# Altium project Cape.PrjPcb (part 1 of 2)
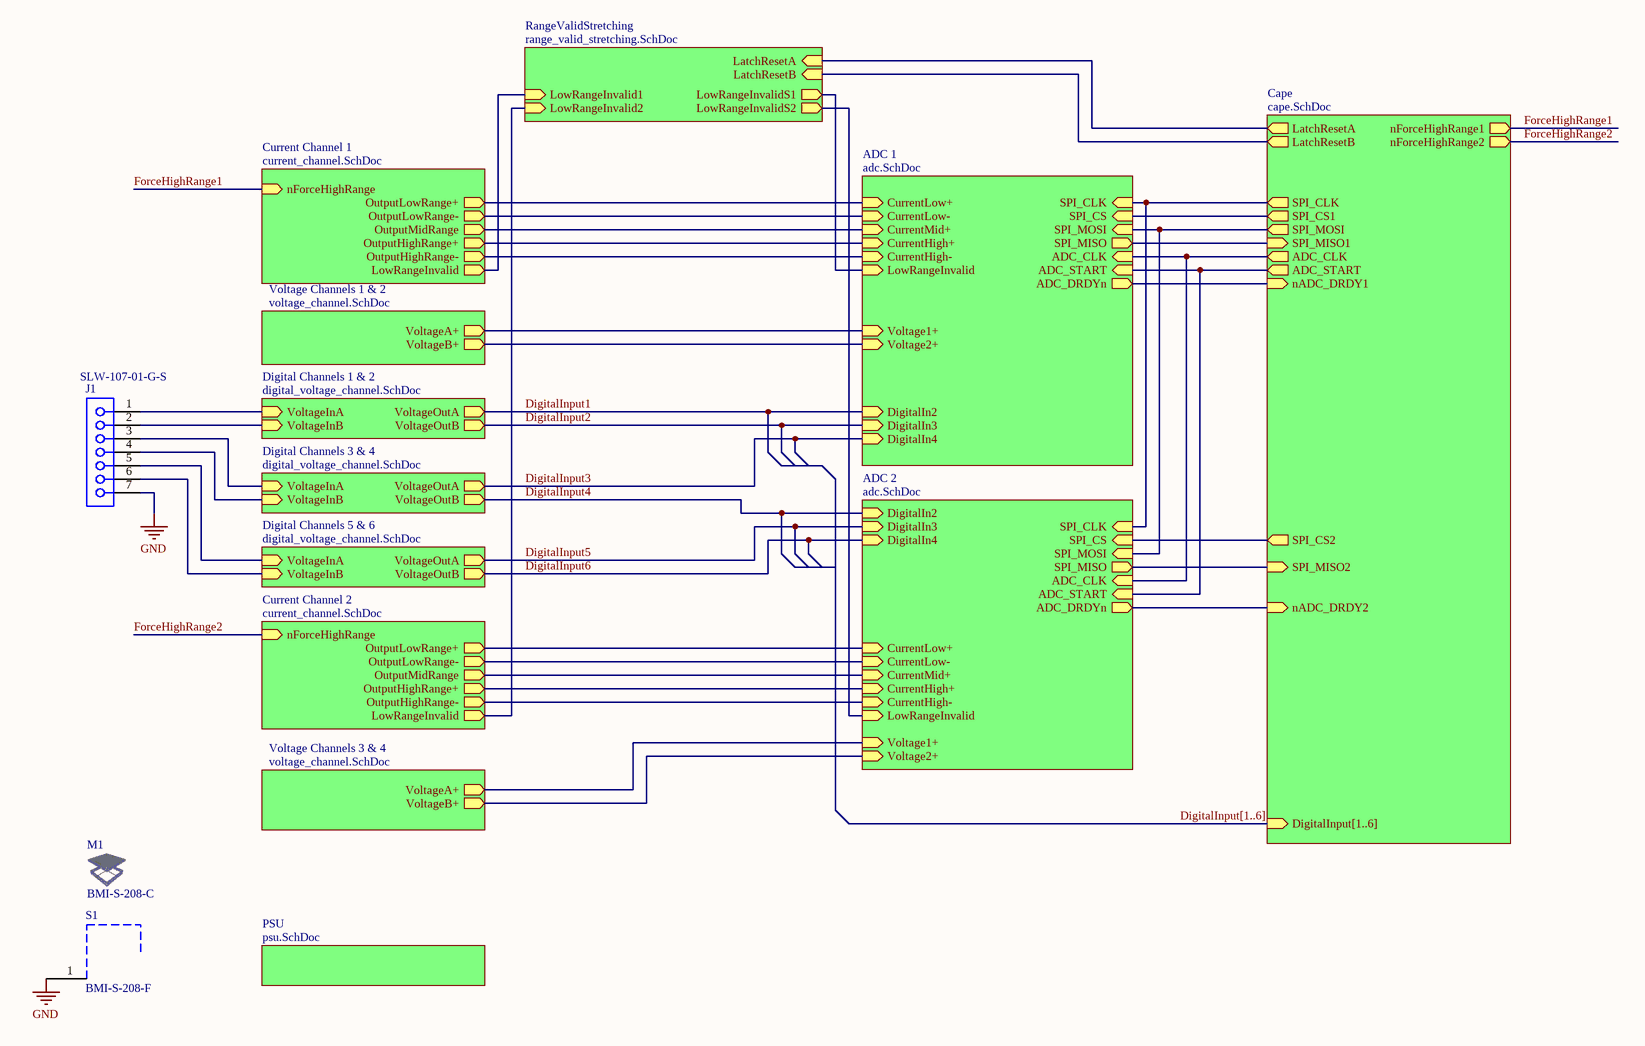
[diagram p0: top.SchDoc]
ProjectName: RocketLogger
8 sheets, 414 parts. Net scope: hierarchical (ports join the sheet entries above them; power ports are global).
Board file: PCB.PcbDoc
Sheets:
  top.SchDoc
    Current Channel 1 = current_channel.SchDoc
    ADC 1 = adc.SchDoc
    PSU = psu.SchDoc
    Cape = cape.SchDoc
    Voltage Channels 3 & 4 = voltage_channel.SchDoc
    Current Channel 2 = current_channel.SchDoc
    Voltage Channels 1 & 2 = voltage_channel.SchDoc
    ADC 2 = adc.SchDoc
    Digital Channels 1 & 2 = digital_voltage_channel.SchDoc
    Digital Channels 3 & 4 = digital_voltage_channel.SchDoc
    Digital Channels 5 & 6 = digital_voltage_channel.SchDoc
    RangeValidStretching = range_valid_stretching.SchDoc

## Sheet top.SchDoc: Top
size A3; DrawnBy: Stefan Lippuner; Organization: TIK; DocumentNumber: 1; Revision: 1; SheetNumber: 1; SheetTotal: 8; ProjectName: RocketLogger

### Parts
J1  SLW-107-01-G-S  [SMTC-SLW-107-01-X-S]
M1  BMI-S-208-C  (mechanical)
S1  BMI-S-208-F  [BMI-S-208-F]

### Sub-sheets
ADC 1 = adc.SchDoc: Voltage1+ (in), Voltage2+ (in), CurrentHigh+ (in), CurrentHigh- (in), CurrentLow+ (in), SPI_CS (in), ADC_DRDYn (out), SPI_MOSI (in), ADC_CLK (in), ADC_START (in), SPI_CLK (in), SPI_MISO (out), LowRangeInvalid (in), DigitalIn3 (in), DigitalIn4 (in), DigitalIn2 (in), CurrentMid+ (in), CurrentLow- (in)
ADC 2 = adc.SchDoc: Voltage1+ (in), Voltage2+ (in), CurrentHigh+ (in), CurrentHigh- (in), CurrentLow+ (in), SPI_CS (in), ADC_DRDYn (out), SPI_MOSI (in), ADC_CLK (in), ADC_START (in), SPI_CLK (in), SPI_MISO (out), LowRangeInvalid (in), DigitalIn3 (in), DigitalIn4 (in), DigitalIn2 (in), CurrentMid+ (in), CurrentLow- (in)
Cape = cape.SchDoc: nADC_DRDY2 (in), SPI_CS1 (out), ADC_CLK (out), SPI_CS2 (out), ADC_START (out), nForceHighRange1 (out), nForceHighRange2 (out), SPI_CLK (out), SPI_MOSI (out), nADC_DRDY1 (in), SPI_MISO1 (in), SPI_MISO2 (in), LatchResetA (out), LatchResetB (out), DigitalInput[1..6] (in)
Current Channel 1 = current_channel.SchDoc: nForceHighRange (in), LowRangeInvalid (out), OutputHighRange+ (out), OutputLowRange+ (out), OutputHighRange- (out), OutputMidRange (out), OutputLowRange- (out)
Current Channel 2 = current_channel.SchDoc: nForceHighRange (in), LowRangeInvalid (out), OutputLowRange+ (out), OutputHighRange+ (out), OutputHighRange- (out), OutputMidRange (out), OutputLowRange- (out)
Digital Channels 1 & 2 = digital_voltage_channel.SchDoc: VoltageOutA (out), VoltageInB (in), VoltageInA (in), VoltageOutB (out)
Digital Channels 3 & 4 = digital_voltage_channel.SchDoc: VoltageOutA (out), VoltageInB (in), VoltageInA (in), VoltageOutB (out)
Digital Channels 5 & 6 = digital_voltage_channel.SchDoc: VoltageOutA (out), VoltageInB (in), VoltageInA (in), VoltageOutB (out)
PSU = psu.SchDoc: no entries
RangeValidStretching = range_valid_stretching.SchDoc: LowRangeInvalid1 (in), LowRangeInvalidS2 (out), LatchResetB (in), LowRangeInvalid2 (in), LatchResetA (in), LowRangeInvalidS1 (out)
Voltage Channels 1 & 2 = voltage_channel.SchDoc: VoltageB+ (out), VoltageA+ (out)
Voltage Channels 3 & 4 = voltage_channel.SchDoc: VoltageB+ (out), VoltageA+ (out)

### Nets
GND: J1.7 S1.1
DigitalInput1: sheet ADC 1/DigitalIn2, sheet Digital Channels 1 & 2/VoltageOutA
DigitalInput2: sheet ADC 1/DigitalIn3, sheet Digital Channels 1 & 2/VoltageOutB
DigitalInput3: sheet ADC 1/DigitalIn4, sheet Digital Channels 3 & 4/VoltageOutA
DigitalInput4: sheet ADC 2/DigitalIn2, sheet Digital Channels 3 & 4/VoltageOutB
DigitalInput5: sheet ADC 2/DigitalIn3, sheet Digital Channels 5 & 6/VoltageOutA
DigitalInput6: sheet ADC 2/DigitalIn4, sheet Digital Channels 5 & 6/VoltageOutB
ForceHighRange1: sheet Current Channel 1/nForceHighRange, sheet Cape/nForceHighRange1
ForceHighRange2: sheet Cape/nForceHighRange2, sheet Current Channel 2/nForceHighRange
OutputMidRange: sheet Current Channel 1/OutputMidRange, sheet ADC 1/CurrentMid+
OutputMidRange: sheet Current Channel 2/OutputMidRange, sheet ADC 2/CurrentMid+  [a separate net that carries the same name]
ShortInput: sheet Current Channel 1/LowRangeInvalid, sheet RangeValidStretching/LowRangeInvalid1
ShortInput: sheet Current Channel 2/LowRangeInvalid, sheet RangeValidStretching/LowRangeInvalid2  [a separate net that carries the same name]
NetC310_1_2: sheet Current Channel 1/OutputLowRange-, sheet ADC 1/CurrentLow-
NetC310_2_2: sheet Current Channel 2/OutputLowRange-, sheet ADC 2/CurrentLow-
NetC311_1_1: sheet Current Channel 1/OutputHighRange-, sheet ADC 1/CurrentHigh-
NetC311_2_1: sheet Current Channel 2/OutputHighRange-, sheet ADC 2/CurrentHigh-
NetJ1_1: J1.1 ; sheet Digital Channels 1 & 2/VoltageInA
NetJ1_2: J1.2 ; sheet Digital Channels 1 & 2/VoltageInB
NetJ1_3: J1.3 ; sheet Digital Channels 3 & 4/VoltageInA
NetJ1_4: J1.4 ; sheet Digital Channels 3 & 4/VoltageInB
NetJ1_5: J1.5 ; sheet Digital Channels 5 & 6/VoltageInA
NetJ1_6: J1.6 ; sheet Digital Channels 5 & 6/VoltageInB
NetR100_1_2: sheet Current Channel 1/OutputHighRange+, sheet ADC 1/CurrentHigh+
NetR100_2_2: sheet Current Channel 2/OutputHighRange+, sheet ADC 2/CurrentHigh+
NetR103_1_2: sheet Current Channel 1/OutputLowRange+, sheet ADC 1/CurrentLow+
NetR103_2_2: sheet Current Channel 2/OutputLowRange+, sheet ADC 2/CurrentLow+
NetR105_1_2: sheet ADC 1/Voltage1+, sheet Voltage Channels 1 & 2/VoltageA+
NetR105_2_2: sheet Voltage Channels 3 & 4/VoltageA+, sheet ADC 2/Voltage1+
NetR106_1_2: sheet ADC 1/Voltage2+, sheet Voltage Channels 1 & 2/VoltageB+
NetR106_2_2: sheet Voltage Channels 3 & 4/VoltageB+, sheet ADC 2/Voltage2+
NetU100_1_34: sheet ADC 1/SPI_MOSI, sheet Cape/SPI_MOSI, sheet ADC 2/SPI_MOSI
NetU100_1_37: sheet ADC 1/ADC_CLK, sheet Cape/ADC_CLK, sheet ADC 2/ADC_CLK
NetU100_1_38: sheet ADC 1/ADC_START, sheet Cape/ADC_START, sheet ADC 2/ADC_START
NetU100_1_39: sheet ADC 1/SPI_CS, sheet Cape/SPI_CS1
NetU100_1_40: sheet ADC 1/SPI_CLK, sheet Cape/SPI_CLK, sheet ADC 2/SPI_CLK
NetU100_1_42: sheet ADC 1/LowRangeInvalid, sheet RangeValidStretching/LowRangeInvalidS1
NetU100_1_43: sheet ADC 1/SPI_MISO, sheet Cape/SPI_MISO1
NetU100_1_47: sheet ADC 1/ADC_DRDYn, sheet Cape/nADC_DRDY1
NetU100_2_39: sheet Cape/SPI_CS2, sheet ADC 2/SPI_CS
NetU100_2_42: sheet ADC 2/LowRangeInvalid, sheet RangeValidStretching/LowRangeInvalidS2
NetU100_2_43: sheet Cape/SPI_MISO2, sheet ADC 2/SPI_MISO
NetU100_2_47: sheet Cape/nADC_DRDY2, sheet ADC 2/ADC_DRDYn
NetU200_914: sheet Cape/LatchResetA, sheet RangeValidStretching/LatchResetA
NetU200_916: sheet Cape/LatchResetB, sheet RangeValidStretching/LatchResetB

### Buses and harness runs
bus DigitalInput[1..6] = sheet Cape/DigitalInput[1..6]

### Notes on the sheet
- 1
- 2
- 3
- 4
- 5
- 6
- 7
- 8
- A
- B
- C
- D
- Project:
- Date:
- Drawing number:
- Rev:
- Format:
- A3
- Drawn by:
- Laboratory:
- Page
- Sheet:
- of
- File:

### Library data of the parts
J1 = CMP-1023-00138-1: Low Profile Socket Strips, Through-hole, Vertical, -55 to 125 degC, 2.54 mm Pitch, 7-Pin, Female, RoHS; Manufacturer: Samtec; Pitch: 2.54 mm; DatasheetVersion: F-214; ComponentLink3URL: http://www.samtec.com/documents/webfiles/cpdf/SLW-1XX-01-X-X-MKT.pdf; ComponentLink1Description: Manufacturer URL; PackageReference: SLW-107-01-X-S; Orientation: Vertical; Temperature Range: -55 to 125 degC; ComponentLink3Description: Package Specification; ComponentLink1URL: http://www.samtec.com; ComponentLink2Description: Datasheet; RoHS: True; Mounting Technology: Through-hole; PackageVersion: X, 9/1987; ComponentLink2URL: http://www.samtec.com/documents/webfiles/pdf/SLW.PDF; PartNumber: SLW-107-01-G-S; PackageDescription: Low Profile Socket Strip
M1 = CMP-00232-1: Board Mount EMI Enclosures RF Absorber CRS Tin SMD; Manufacturer: Laird; rohs_status: Compliant; Octopart Url: http://octopart.com/bmi-s-208-c-laird-25737658; Seller Landing  Url: https://octopart-clicks.com/click/track?country=CH&ak=8157f166&sig=01c10b9&sid=2401&ppid=25737658&vpid=232400018&ct=offers; OctopartID: da4312c1469f0584; Supplier: Mouser; Supplier Part Number: Mouser - 739-BMI-S-208-C
S1 = CMP-00123-2: EMI Connector Gaskets & Grounding Pads BLS,2PSH,FRM,SnSat .276x1.559x1.559in; Manufacturer: Laird Technologies EMI; Packaging: Tape & Reel (TR); Type: Frame; Height - Overall: 0.276" (7.00mm); Length - Overall: 1.559" (39.60mm); Width - Overall: 1.559" (39.60mm); Ventilation: -; Mounting Type: Solder; Manufacturer Part Number: BMI-S-208-F; Supplier: Digi-Key; Supplier Part Number: BMI-S-208-F-ND; ComponentLink1Description: EMI-CAT-Essentials%201213.pdf; ComponentLink1URL: http://www.lairdtech.com/brandworld/library/EMI-CAT-Essentials%201213.pdf

## Sheet current_channel.SchDoc: Current Channel
size A3; DrawnBy: Stefan Lippuner; Organization: TIK; DocumentNumber: 5; Revision: 1.1; SheetNumber: 5; SheetTotal: 8; PageSetup: Record=PageOptions|CenterHorizontal=True|CenterVertical=True|PrintScale=1.00|XCorrection=1.00|YCorrection=1.00|PrintKind=1|BorderSize=5000000|LeftOffset=0|BottomOffset=0|Orientation=2|PaperLength=1000|PaperWidth=1000|Scale=100|PaperSource=7|PrintQuality=-3|MediaType=1|DitherType=10|PrintScaleMode=1|PaperKind=A3|PaperIndex=8
Used 2 times, as channels Current Channel 1, Current Channel 2. Parts and nets are listed once, with the designators drawn on the sheet.
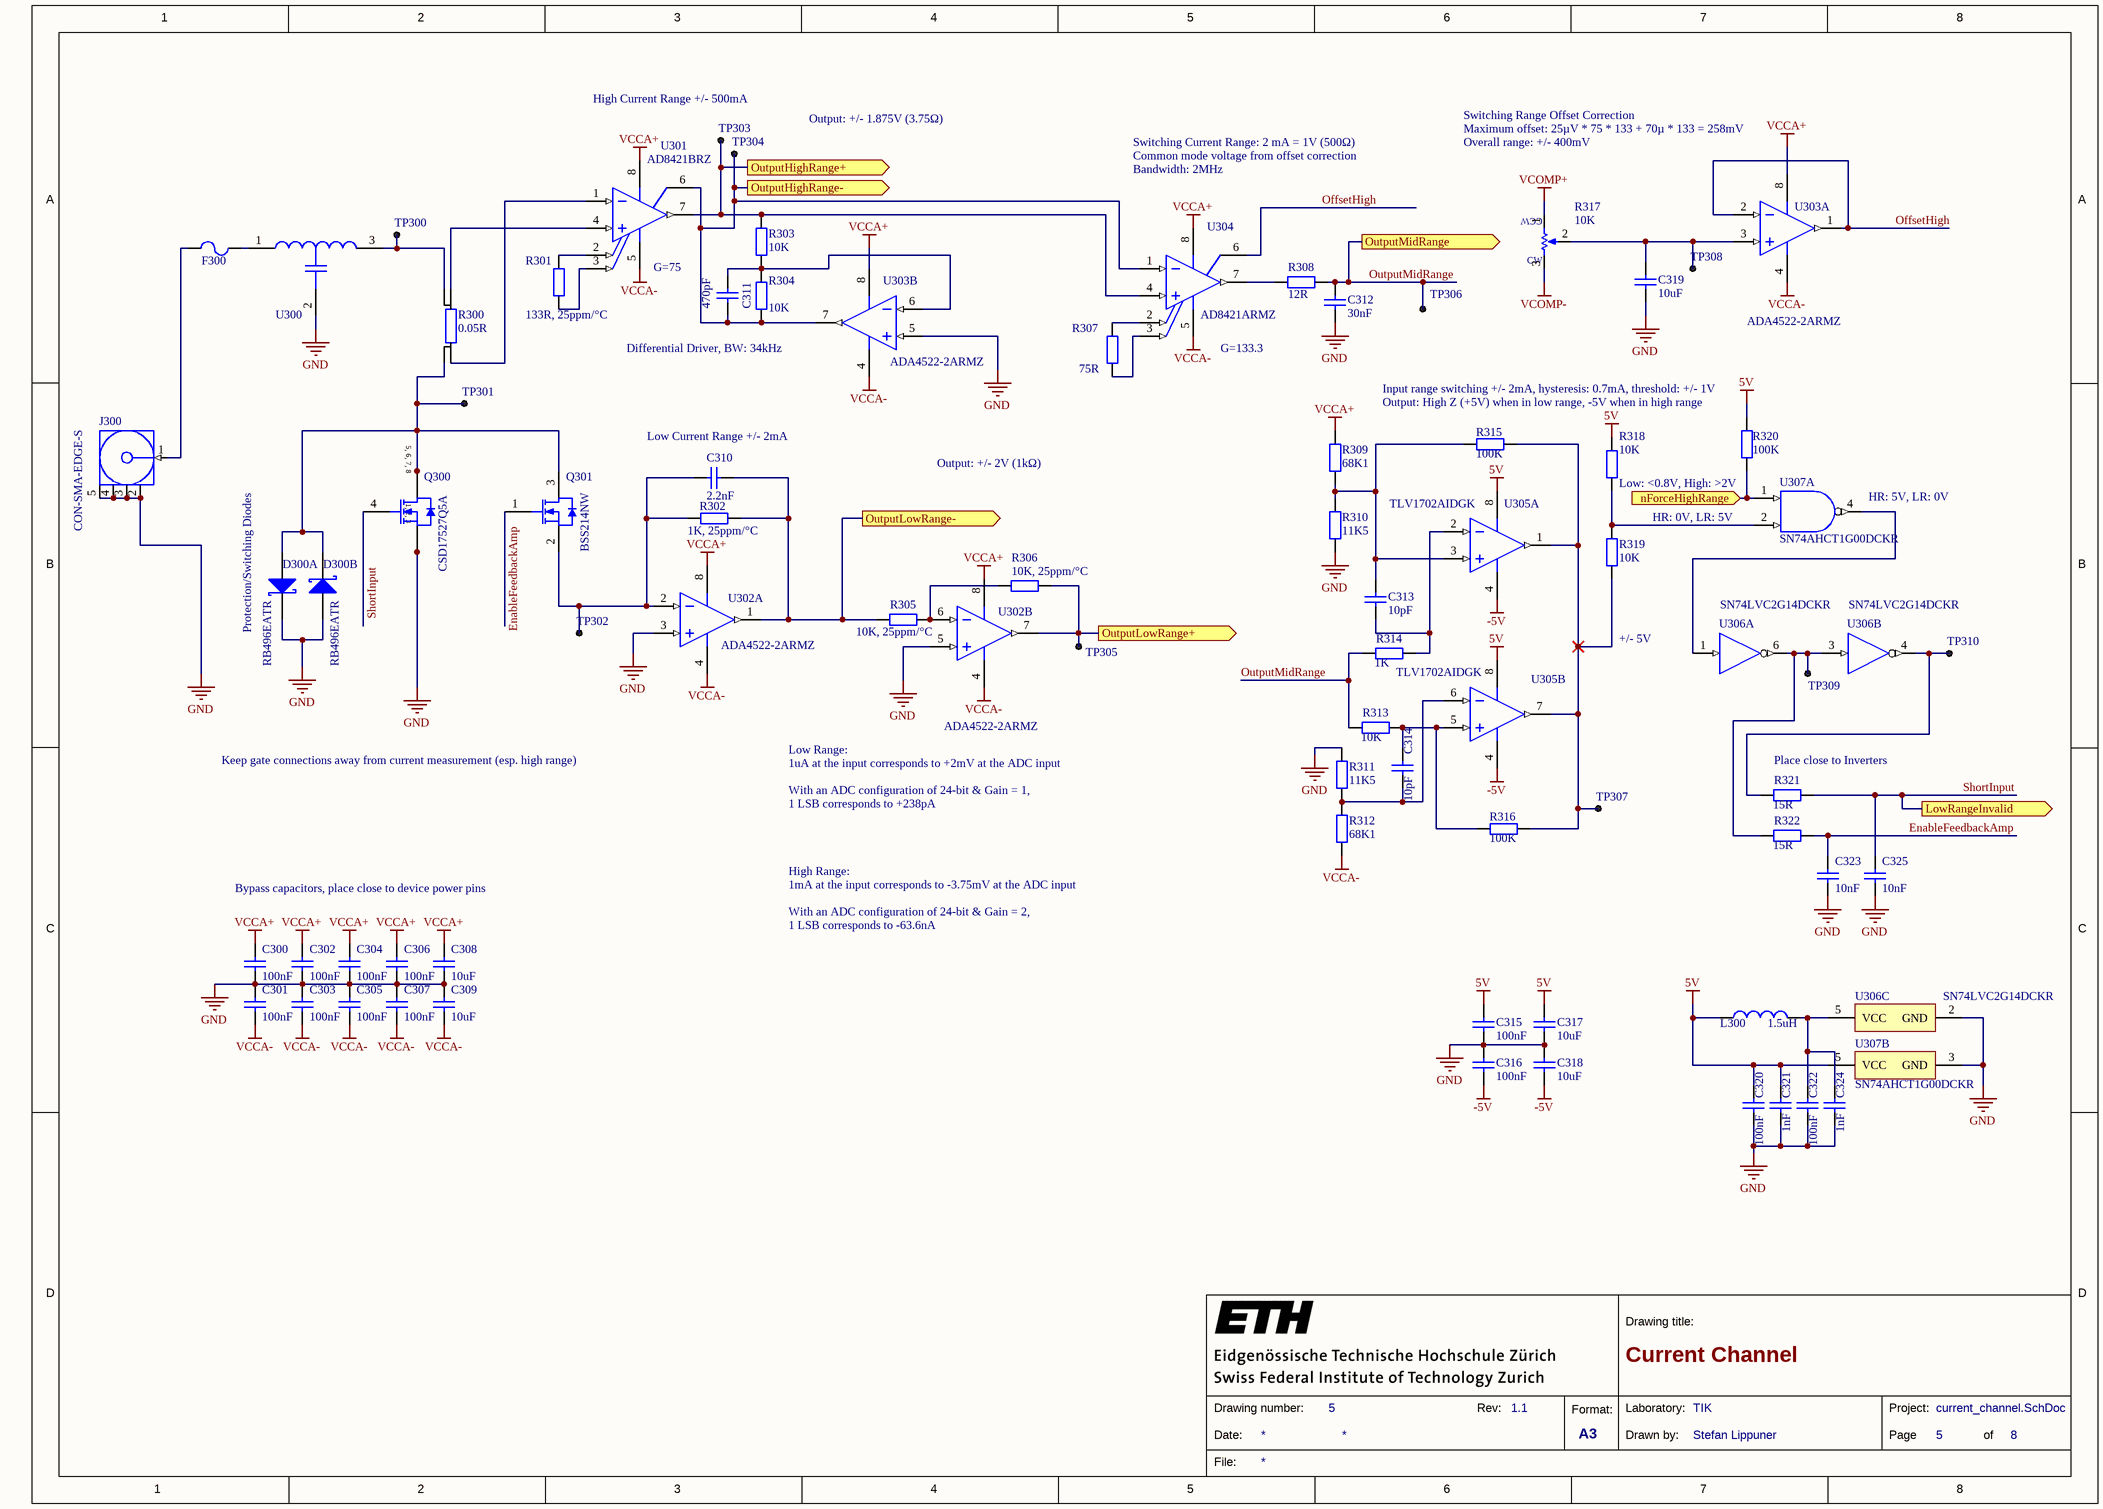
[diagram p1: current_channel.SchDoc]

### Parts
(Parts that share a designator on the sheet are numbered #1, #2 ... from top to bottom, then left to right.)
C300  100nF  [CAPC0402(1005)60_L]
C301  100nF  [CAPC0402(1005)60_L]
C302  100nF  [CAPC0402(1005)60_L]
C303  100nF  [CAPC0402(1005)60_L]
C304  100nF  [CAPC0402(1005)60_L]
C305  100nF  [CAPC0402(1005)60_L]
C306  100nF  [CAPC0402(1005)60_L]
C307  100nF  [CAPC0402(1005)60_L]
C308  10uF  [CAPC0603(1608)100_L]
C309  10uF  [CAPC0603(1608)100_L]
C310  2.2nF  [CAPC0402(1005)60_L]
C311  470pF  [CAPC0402(1005)60_L]
C312  30nF  [CAPC0402(1005)60_L]
C313  10pF  [CAPC0402(1005)60_L]
C314  10pF  [CAPC0402(1005)60_L]
C315  100nF  [CAPC0402(1005)60_L]
C316  100nF  [CAPC0402(1005)60_L]
C317  10uF  [CAPC0603(1608)100_L]
C318  10uF  [CAPC0603(1608)100_L]
C319  10uF  [CAPC0603(1608)100_L]
C320  100nF  [CAPC0402(1005)60_L]
C321  1nF  [CAPC0402(1005)60_L]
C322  100nF  [CAPC0402(1005)60_L]
C323  10nF  [CAPC0402(1005)60_L]
C324  1nF  [CAPC0402(1005)60_L]
C325  10nF  [CAPC0402(1005)60_L]
D300  RB496EATR  [Z5+1_L]  (parts A,B of 2)
F300  046702.5NR  [RESC0603(1608)_L]  (value not drawn)
J300  CON-SMA-EDGE-S  [132322]
L300  1.5uH  [INDC0603(1608)_L]
Q300  CSD17527Q5A  [PowerPAK_SO-8_V]
Q301  BSS214NW  [INF-PG-SOT-323_L]
R300  value 0.05R  [WSK1206]  (hidden comment: WSK1206R0500FEA)
R301  133R, 25ppm/°C  [RESC0402(1005)_L]
R302  1K, 25ppm/°C  [RESC0402(1005)_L]
R303  10K  [RESC0402(1005)_L]
R304  10K  [RESC0402(1005)_L]
R305  10K, 25ppm/°C  [RESC0402(1005)_L]
R306  10K, 25ppm/°C  [RESC0402(1005)_L]
R307  75R  [RESC0402(1005)_L]
R308  12R  [RESC0402(1005)_L]
R309  68K1  [RESC0402(1005)_L]
R310  11K5  [RESC0402(1005)_L]
R311  11K5  [RESC0402(1005)_L]
R312  68K1  [RESC0402(1005)_L]
R313  10K  [RESC0402(1005)_L]
R314  1K  [RESC0402(1005)_L]
R315  100K  [RESC0402(1005)_L]
R316  100K  [RESC0402(1005)_L]
R317  value 10K  [43W]  (hidden comment: 43WR10KLFTR)
R318  10K  [RESC0402(1005)_L]
R319  10K  [RESC0402(1005)_L]
R320  100K  [RESC0402(1005)_L]
R321  15R  [RESC0402(1005)_L]
R322  15R  [RESC0402(1005)_L]
TP300  (no value)  [Pad-0.6mm]  (no BOM)
TP301  (no value)  [Pad-0.6mm]  (no BOM)
TP302  (no value)  [Pad-0.6mm]  (no BOM)
TP303  (no value)  [Pad-0.6mm]  (no BOM)
TP304  (no value)  [Pad-0.6mm]  (no BOM)
TP305  (no value)  [Pad-0.6mm]  (no BOM)
TP306  (no value)  [Pad-0.6mm]  (no BOM)
TP307  (no value)  [Pad-0.6mm]  (no BOM)
TP308  (no value)  [Pad-0.6mm]  (no BOM)
TP309  (no value)  [Pad-0.6mm]  (no BOM)
TP310  (no value)  [Pad-0.6mm]  (no BOM)
U300  ACH32C-470-T001  [ACH32C]  (value not drawn)
U301  AD8421BRZ  [M08A_L]
U302#1  ADA4522-2ARMZ  [ADI-RM-8_L]  (part A of 2)
U302#2  ADA4522-2ARMZ  [ADI-RM-8_L]  (part B of 2)
U303  ADA4522-2ARMZ  [ADI-RM-8_L]  (parts A,B of 2)
U304  AD8421ARMZ  [ADI-RM-8_L]
U305  TLV1702AIDGK  [ADI-RM-8_L]  (parts A,B of 2)
U306  SN74LVC2G14DCKR  [DCK0006A_L]  (parts A,B,C of 3)
U307  SN74AHCT1G00DCKR  [DCK0005A_L]  (parts A,B of 2)

### Ports
LowRangeInvalid (out), nForceHighRange (in), OutputHighRange+ (out), OutputHighRange- (out), OutputLowRange+ (out), OutputLowRange- (out), OutputMidRange (out)

### Nets
5V: C315.2 C317.2 C320.2 C321.2 L300.1 R318.2 R320.2 U305.8(V+) U307.5(VCC)
-5V: C316.1 C318.1 U305.4(V-)
GND: C300.1 C301.2 C302.1 C303.2 C304.1 C305.2 C306.1 C307.2 C308.1 C309.2 C312.1 C315.1 C316.2 C317.1 C318.2 C319.1 C320.1 C321.1 C322.1 C323.1 C324.1 C325.1 D300.3(A) D300.5(K) J300.2(GND) J300.3(GND) J300.4(GND) J300.5(GND) Q300.1(S) Q300.2(S) Q300.3(S) R310.1 R311.2 U300.2 U302#1.3(1IN+) U302#2.5(2IN+) U303.5(2IN+) U306.2(GND) U307.3(GND)
VCCA+: C300.2 C302.2 C304.2 C306.2 C308.2 R309.2 U301.8(+VS) U302#1.8(V+) U302#2.8(V+) U303.8(V+) U304.8(+VS)
VCCA-: C301.1 C303.1 C305.1 C307.1 C309.1 R312.1 U301.5(-VS) U302#1.4(V-) U302#2.4(V-) U303.4(V-) U304.5(-VS)
VCOMP+: R317.1(CCW)
VCOMP-: R317.3(CW)
EnableFeedbackAmp: C323.2 Q301.1(GATE) R322.1
nForceHighRange: R320.1 U307.1(A) ; port nForceHighRange
OffsetHigh: U303.1(1OUT) U303.2(1IN-) U304.6(REF)
OutputHighRange+: R303.2 TP303.1 U301.7(VOUT) U304.4(+IN) ; port OutputHighRange+
OutputHighRange-: C311.1 R304.1 TP304.1 U301.6(REF) U303.7(2OUT) U304.1(-IN) ; port OutputHighRange-
OutputLowRange+: R306.1 TP305.1 U302#2.7(2OUT) ; port OutputLowRange+
OutputLowRange-: C310.2 R302.1 R305.2 U302#1.1(1OUT) ; port OutputLowRange-
OutputMidRange: C312.2 R308.2 R313.2 R314.1 TP306.1 ; port OutputMidRange
ShortInput: C325.2 Q300.4(G) R321.1 ; port LowRangeInvalid
NetC310_1: C310.1 Q301.2(SOURCE) R302.2 TP302.1 U302#1.2(1IN-)
NetC311_2: C311.2 R303.1 R304.2 U303.6(2IN-)
NetC313_1: C313.1 R309.1 R310.2 R315.1 U305.3(1IN+)
NetC313_2: C313.2 R314.2 U305.2(1IN-)
NetC314_1: C314.1 R313.1 R316.1 U305.5(2IN+)
NetC314_2: C314.2 R311.1 R312.2 U305.6(2IN-)
NetC319_2: C319.2 R317.2(WIPER) TP308.1 U303.3(1IN+)
NetC322_2: C322.2 C324.2 L300.2 U306.5(VCC)
NetD300_1: D300.1(A) D300.4(K) Q300.5(D) Q300.6(D) Q300.7(D) Q300.8(D) Q301.3(DRAIN) R300.3(SENSE_1) TP301.1
NetF300_1: F300.1 J300.1(Signal)
NetF300_2: F300.2 U300.1
NetR300_1: R300.1 U301.1(-IN)
NetR300_2: R300.2 U301.4(+IN)
NetR300_4: R300.4(SENSE_2) TP300.1 U300.3
NetR301_1: R301.1 U301.3(RG3)
NetR301_2: R301.2 U301.2(RG2)
NetR305_1: R305.1 R306.2 U302#2.6(2IN-)
NetR307_1: R307.1 U304.3(RG3)
NetR307_2: R307.2 U304.2(RG2)
NetR308_1: R308.1 U304.7(VOUT)
NetR315_2: R315.2 R316.2 R319.1 TP307.1 U305.1(1OUT) U305.7(2OUT)
NetR318_1: R318.1 R319.2 U307.2(B)
NetR321_2: R321.2 TP310.1 U306.4(2Y)
NetR322_2: R322.2 TP309.1 U306.3(2A) U306.6(1Y)
NetU306_1: U306.1(1A) U307.4(Y)

### Channels
Current Channel 1: designators C300=C300_1 C301=C301_1 C302=C302_1 C303=C303_1 C304=C304_1 C305=C305_1 C306=C306_1 C307=C307_1 C308=C308_1 C309=C309_1 C310=C310_1 C311=C311_1 C312=C312_1 C313=C313_1 C314=C314_1 C315=C315_1 C316=C316_1 C317=C317_1 C318=C318_1 C319=C319_1 C320=C320_1 C321=C321_1 C322=C322_1 C323=C323_1 C324=C324_1 C325=C325_1 D300=D300_1 F300=F300_1 J300=J300_1 L300=L300_1 Q300=Q300_1 Q301=Q301_1 R300=R300_1 R301=R301_1 R302=R302_1 R303=R303_1 R304=R304_1 R305=R305_1 R306=R306_1 R307=R307_1 R308=R308_1 R309=R309_1 R310=R310_1 R311=R311_1 R312=R312_1 R313=R313_1 R314=R314_1 R315=R315_1 R316=R316_1 R317=R317_1 R318=R318_1 R319=R319_1 R320=R320_1 R321=R321_1 R322=R322_1 TP300=TP300_1 TP301=TP301_1 TP302=TP302_1 TP303=TP303_1 TP304=TP304_1 TP305=TP305_1 TP306=TP306_1 TP307=TP307_1 TP308=TP308_1 TP309=TP309_1 TP310=TP310_1 U300=U300_1 U301=U301_1 U302=U302_1#1 U302=U302_1#2 U303=U303_1 U304=U304_1 U305=U305_1 U306=U306_1 U307=U307_1; ports LowRangeInvalid=ShortInput nForceHighRange=ForceHighRange1 OutputHighRange+=NetR100_1_2 OutputHighRange-=NetC311_1_1 OutputLowRange+=NetR103_1_2 OutputLowRange-=NetC310_1_2 OutputMidRange=OutputMidRange
Current Channel 2: designators C300=C300_2 C301=C301_2 C302=C302_2 C303=C303_2 C304=C304_2 C305=C305_2 C306=C306_2 C307=C307_2 C308=C308_2 C309=C309_2 C310=C310_2 C311=C311_2 C312=C312_2 C313=C313_2 C314=C314_2 C315=C315_2 C316=C316_2 C317=C317_2 C318=C318_2 C319=C319_2 C320=C320_2 C321=C321_2 C322=C322_2 C323=C323_2 C324=C324_2 C325=C325_2 D300=D300_2 F300=F300_2 J300=J300_2 L300=L300_2 Q300=Q300_2 Q301=Q301_2 R300=R300_2 R301=R301_2 R302=R302_2 R303=R303_2 R304=R304_2 R305=R305_2 R306=R306_2 R307=R307_2 R308=R308_2 R309=R309_2 R310=R310_2 R311=R311_2 R312=R312_2 R313=R313_2 R314=R314_2 R315=R315_2 R316=R316_2 R317=R317_2 R318=R318_2 R319=R319_2 R320=R320_2 R321=R321_2 R322=R322_2 TP300=TP300_2 TP301=TP301_2 TP302=TP302_2 TP303=TP303_2 TP304=TP304_2 TP305=TP305_2 TP306=TP306_2 TP307=TP307_2 TP308=TP308_2 TP309=TP309_2 TP310=TP310_2 U300=U300_2 U301=U301_2 U302=U302_2#1 U302=U302_2#2 U303=U303_2 U304=U304_2 U305=U305_2 U306=U306_2 U307=U307_2; ports LowRangeInvalid=ShortInput nForceHighRange=ForceHighRange2 OutputHighRange+=NetR100_2_2 OutputHighRange-=NetC311_2_1 OutputLowRange+=NetR103_2_2 OutputLowRange-=NetC310_2_2 OutputMidRange=OutputMidRange

### Notes on the sheet
- High Current Range +/- 500mA
- Output: +/- 1.875V (3.75Ω)
- Switching Current Range: 2 mA = 1V (500Ω)
  Common mode voltage from offset correction
  Bandwidth: 2MHz
- (near U303) Switching Range Offset Correction
  Maximum offset: 25µV * 75 * 133 + 70µ * 133 = 258mV
  Overall range: +/- 400mV
- (near U301) G=75
- Differential Driver, BW: 34kHz
- (near U304) G=133.3
- (near C310) Low Current Range +/- 2mA
- Input range switching +/- 2mA, hysteresis: 0.7mA, threshold: +/- 1V
- Output: High Z (+5V) when in low range, -5V when in high range
- Output: +/- 2V (1kΩ)
- (near R318) Low: <0.8V, High: >2V
- (near U307) HR: 5V, LR: 0V
- HR: 0V, LR: 5V
- (near D300) Protection/Switching Diodes
- +/- 5V
- Keep gate connections away from current measurement (esp. high range)
- (near R321) Place close to Inverters
- Low Range:
  1uA at the input corresponds to +2mV at the ADC input
  With an ADC configuration of 24-bit & Gain = 1,
  1 LSB corresponds to +238pA
- Bypass capacitors, place close to device power pins
- High Range:
  1mA at the input corresponds to -3.75mV at the ADC input
  With an ADC configuration of 24-bit & Gain = 2,
  1 LSB corresponds to -63.6nA
- 1
- 2
- 3
- 4
- 5
- 6
- 7
- 8
- A
- B
- C
- D
- Drawing title:
- Date:
- Drawing number:
- Rev:
- Format:
- A3
- Drawn by:
- Laboratory:
- Page
- Project:
- of
- File:
- (in symbol CMP-00221-1) 5, 6, 7, 8; 1, 2, 3

### Library data of the parts
C300-C307 C315 C316 C320 C322 = CMP-1034-02071-1: CAP 100nF 16V -20% to +80% 0402 (1005 Metric) Thickness 0.6mm SMD; Case-Metric: 1005; Case-EIA: 0402; Value: 100nF; Rated Voltage: 16 V; Tolerance: -20% to +80%; Technology: SMT; Max Thickness: 0.6 mm
C308 C309 C317-C319 = CMP-1035-02800-1: CAP 10uF 10V ±20% 0603 (1608 Metric) Thickness 1mm SMD; Tolerance: Â±20%; Case-EIA: 0603; Case-Metric: 1608; Max Thickness: 1 mm; Rated Voltage: 10 V; Technology: SMT; Value: 10uF
C310 = CMP-1034-01735-1: CAP 2.2nF 25V ±1% 0402 (1005 Metric) Thickness 0.6mm SMD; Case-EIA: 0402; Tolerance: Â±1%; Case-Metric: 1005; Technology: SMT; Value: 2.2nF; Max Thickness: 0.6 mm; Rated Voltage: 25 V
C311 = CMP-1034-01504-1: CAP 470pF 100V ±1% 0402 (1005 Metric) Thickness 0.6mm SMD; Case-Metric: 1005; Case-EIA: 0402; Tolerance: Â±1%; Max Thickness: 0.6 mm; Technology: SMT; Value: 470pF; Rated Voltage: 100 V
C312 = CMP-1590-00004-1: 0402 (1005 Metric) Chip Capacitor; Case-EIA: 0402; Case-Metric: 1005; Value: 30nF; PackageReference: CAPC0402(1005)60
C313 C314 = CMP-1034-00730-1: CAP 10pF 100V ±10% 0402 (1005 Metric) Thickness 0.6mm SMD; Tolerance: Â±10%; Case-EIA: 0402; Case-Metric: 1005; Technology: SMT; Rated Voltage: 100 V; Value: 10pF; Max Thickness: 0.6 mm
C321 C324 = CMP-1034-01609-1: CAP 1nF 6.3V ±5% 0402 (1005 Metric) Thickness 0.6mm SMD; Case-EIA: 0402; Tolerance: Â±5%; Case-Metric: 1005; Rated Voltage: 6.3 V; Value: 1nF; Technology: SMT; Max Thickness: 0.6 mm
C323 C325 = CMP-1034-01870-1: CAP 10nF 10V ±5% 0402 (1005 Metric) Thickness 0.6mm SMD; Tolerance: Â±5%; Case-EIA: 0402; Case-Metric: 1005; Value: 10nF; Technology: SMT; Max Thickness: 0.6 mm; Rated Voltage: 10 V
D300 = CMP-00093-1: DIODE ARRAY SCHOTTKY 20V TSMD5; Manufacturer: Rohm Semiconductor; Diode Configuration: 2 Independent; Current - Average Rectified (Io) (per Diode): 1A; Voltage - Forward (Vf) (Max) @ If: 400mV @ 1A; Speed: Fast Recovery =< 500ns, > 200mA (Io); Current - Reverse Leakage @ Vr: 500µA @ 10V; Packaging: Digi-Reel®; Diode Type: Schottky; Voltage - DC Reverse (Vr) (Max): 20V; Mounting Type: Surface Mount; Package / Case: SOT-23-5 Thin, TSOT-23-5; Supplier Device Package: TSMD5; P/N: RB496EATR; Supplier: Digi-Key; Supplier Part Number: RB496EADKR-ND; ComponentLink1Description: rb496ea.pdf; ComponentLink1URL: http://rohmfs.rohm.com/en/products/databook/datasheet/discrete/diode/schottky_barrier/rb496ea.pdf
F300 = CMP-00099-1: Fuse Chip Very Fast Acting 2.5A 32V SMD Solder Pad 0603; Manufacturer: Littelfuse Inc.; Fuse Type: Board Mount (Cartridge Style Excluded); Breaking Capacity @ Rated Voltage: 35A; Melting I²t: 0.2066; Approvals: CSA, UL; DC Cold Resistance: 0.021 Ohm; Packaging: Tape & Reel (TR); Current Rating: 2.5A; Voltage Rating - AC: 32V; Voltage Rating - DC: 32V; Response Time: Fast; Package / Case: 0603 (1608 Metric); Mounting Type: Surface Mount; Operating Temperature: -55°C ~ 90°C; Color: -; Size / Dimension: 0.063" L x 0.032" W x 0.012" H (1.60mm x 0.81mm x 0.31mm); P/N: 046702.5NR; Supplier: Digi-Key; Supplier Part Number: F1398TR-ND; ComponentLink1Description: littelfuse_fuse_467_datasheet.pdf.pdf; ComponentLink1URL: http://www.littelfuse.com/~/media/electronics/datasheets/fuses/littelfuse_fuse_467_datasheet.pdf.pdf
J300 = CMP-00231-1: SMA FEMALE PCB EDGE MOUNT; Manufacturer: RF Solutions; Connector Type: Jack, Female Socket; Contact Termination: Solder; Packaging: -; Part Status: Active; Connector Style: SMA; Shield Termination: Solder; Impedance: -; Mounting Type: Board Edge, End Launch; Cable Group: -; Fastening Type: Threaded; Frequency - Max: -; Features: -; Housing Color: -; Ingress Protection: -; Body Material: -; Body Finish: -; Center Contact Material: -; Center Contact Plating: -; Dielectric Material: -; Voltage Rating: -; Operating Temperature: -; Manufacturer Part Number: CON-SMA-EDGE-S; Supplier: Digi-Key; Supplier Part Number: CON-SMA-EDGE-S-ND
L300 = CMP-00229-1: FIXED IND 1.5UH 50MA 700 MOHM; Manufacturer: TDK Corporation; Manufacturer Part Number: MLF1608A1R5M; Type: Multilayer; Material - Core: Ferrite; Inductance: 1.5µH; Tolerance: ±20%; Shielding: Shielded; DC Resistance (DCR): 700 mOhm Max; Q @ Freq: 35 @ 10MHz; Frequency - Self Resonant: 100MHz; Frequency - Test: 10MHz; Packaging: Cut Tape (CT); Part Status: Active; Current Rating: 50mA; Current - Saturation: -; Ratings: -; Operating Temperature: -40°C ~ 85°C; Mounting Type: Surface Mount; Package / Case: 0603 (1608 Metric); Size / Dimension: 0.063" L x 0.031" W (1.60mm x 0.80mm); Height - Seated (Max): 0.037" (0.95mm); Supplier: Digi-Key; Supplier Part Number: 445-6221-1-ND; ComponentLink1Description: inductor_commercial_standard_mlf1608_en.pdf; ComponentLink1URL: https://product.tdk.com/info/en/catalog/datasheets/inductor_commercial_standard_mlf1608_en.pdf
Q300 = CMP-00221-1: MOSFET N-CH 30V 65A 8SON; Manufacturer: Texas Instruments; FET Type: MOSFET N-Channel, Metal Oxide; FET Feature: Standard; Current - Continuous Drain (Id) @ 25°C: 65A (Tc); Rds On (Max) @ Id, Vgs: 10.8 mOhm @ 11A, 10V; Vgs(th) (Max) @ Id: 2V @ 250µA; Gate Charge (Qg) @ Vgs: 3.4nC @ 4.5V; Input Capacitance (Ciss) @ Vds: 506pF @ 15V; Power - Max: 3W; Packaging: Cut Tape (CT); Part Status: Active; Drain to Source Voltage (Vdss): 30V; Operating Temperature: -55°C ~ 150°C (TJ); Mounting Type: Surface Mount; Package / Case: 8-PowerTDFN; Supplier Device Package: 8-VSON (5x6); Manufacturer Part Number: CSD17527Q5A; Supplier: Digi-Key; Supplier Part Number: 296-29021-1-ND; ComponentLink1Description: csd17527q5a.pdf; ComponentLink1URL: http://www.ti.com/lit/ds/symlink/csd17527q5a.pdf
Q301 = CMP-1149-00041-1: N-Channel OptiMOS 2 Small-Signal-Transistor, 20 V VDS, 1.5 A ID, -55 to 150 degC, PG-SOT-323, Reel, Green; Manufacturer: Infineon; VDS (max): 20 V; VGS(th) (max): 1.2Â V; RthJA (max): 250 K/W; QG: 0.8Â nC; RDS (on) (max) (@4.5V): 140 mOhm; VGS(th) (min): 0.7Â V; IDpuls (max): 6 A; ID (max): 1.5Â A; Ptot (max): 0.5Â W; RDS (on) (max): 250 mOhm; Green: TRUE; PackageDescription: 3-Pin Small Outline Transistor Package, 2 x 1.25 mm Body, 0.65 mm Pitch; ComponentLink3URL: http://www.infineon.com/dgdl/SOT323-Package_Overview.pdf?folderId=db3a30431936bc4b0119533e1dcb3c92&fileId=db3a30431936bc4b011953495f283cb1; DatasheetVersion: Rev. 2.2; Mounting Technology: Surface Mount; ComponentLink2URL: http://www.infineon.com/dgdl/BSS214NW_Rev2.2.pdf?folderId=db3a3043156fd573011622e10b5c1f67&fileId=db3a30431b3e89eb011b695aebc01bde; PackageVersion: Apr-08; Halogen-free: TRUE; Packing: Reel; ComponentLink3Description: Package Specification; PartNumber: BSS214NW; ComponentLink2Description: Datasheet; PackageReference: PG-SOT-323; ComponentLink1URL: http://www.infineon.com/; RDS (on) (max) (@2.5V): 250 mOhm; ComponentLink1Description: Manufacturer URL
R300 = CMP-00094-1: RES SMD 0.05 OHM 1% 1/4W 1206; Manufacturer: Vishay Dale; Resistance (Ohms): 0.05; Power (Watts): 0.25W, 1/4W; Temperature Coefficient: ±35ppm/°C; Packaging: Cut Tape (CT); Tolerance: ±1%; Composition: Metal Element; Features: Current Sense, Moisture Resistant, Pulse Withstanding; Operating Temperature: -65°C ~ 170°C; Package / Case: 1206 (3216 Metric), Concave; Supplier Device Package: 1206; Size / Dimension: 0.126" L x 0.063" W (3.20mm x 1.60mm); Height: 0.035" (0.89mm); Number of Terminations: 2; Manufacturer Part Number: WSK1206R0500FEA; Supplier: Digi-Key; Supplier Part Number: 541-2707-1-ND; ComponentLink1Description: wsk1206.pdf; ComponentLink1URL: http://www.vishay.com/docs/30195/wsk1206.pdf
R301 = CMP-1011-00410-1: 133R, 0.1%, 25ppm/°C; Tolerance: 1 %; Case-Metric: 1005; Value: 133.00 Ohm; Power: 0.063 W; Case-EIA: 0402; Technology: SMT
R302 R314 = CMP-1011-00510-1: 1K 0.063W 1% 0402 (1005 Metric)  SMD; Case-EIA: 0402; Value: 1000.00 Ohm; Case-Metric: 1005; Technology: SMT; Tolerance: 1 %; Power: 0.063 W
R303-R306 R313 R318 R319 = CMP-1011-00623-1: 10K 0.063W 1% 0402 (1005 Metric)  SMD; Case-Metric: 1005; Value: 10000.00 Ohm; Case-EIA: 0402; Tolerance: 1 %; Technology: SMT; Power: 0.063 W
R307 = CMP-1011-00383-1: 75R 0.063W 1% 0402 (1005 Metric)  SMD; Case-Metric: 1005; Case-EIA: 0402; Value: 75.00 Ohm; Power: 0.063 W; Tolerance: 1 %; Technology: SMT
R308 = CMP-1011-00001-1: 12R 0.063W 1% 0402 (1005 Metric)  SMD; Tolerance: None; Case-Metric: 1005; Case-EIA: 0402; Power: None; Value: 12R; Technology: SMT
R309 R312 = CMP-1011-00718-1: 68K1 0.063W 1% 0402 (1005 Metric)  SMD; Case-Metric: 1005; Value: 68100.00 Ohm; Case-EIA: 0402; Technology: SMT; Tolerance: 1 %; Power: 0.063 W
R310 R311 = CMP-1011-00629-1: 11K5 0.063W 1% 0402 (1005 Metric)  SMD; Case-EIA: 0402; Case-Metric: 1005; Value: 11500.00 Ohm; Power: 0.063 W; Technology: SMT; Tolerance: 1 %
R315 R316 R320 = CMP-1011-00801-1: 100K 0.063W 1% 0402 (1005 Metric)  SMD; Case-Metric: 1005; Value: 100000.00 Ohm; Case-EIA: 0402; Tolerance: 1 %; Technology: SMT; Power: 0.063 W
R317 = CMP-00121-2: TRIMMER 10K OHM 0.125W SMD; Manufacturer: TT Electronics/BI; Power (Watts): 0.125W, 1/8W; Tolerance: ±20%; Temperature Coefficient: ±100ppm/°C; Number of Turns: 11; Adjustment Type: Top Adjustment; Resistive Material: Cermet; Packaging: Tape & Reel (TR); Resistance (Ohms): 10k; Mounting Type: Surface Mount; Termination Style: J Lead; Size / Dimension: Rectangular - 0.161" x 0.125" Face x 0.161" H (4.10mm x 3.18mm x 4.10mm); P/N: 43WR10KLFTR; Supplier: Digi-Key; Supplier Part Number: 987-1030-2-ND; ComponentLink1Description: 43.pdf; ComponentLink1URL: http://www.bitechnologies.com/pdfs/43.pdf
R321 R322 = CMP-1011-00302-1: 15R 0.063W 1% 0402 (1005 Metric)  SMD; Case-Metric: 1005; Case-EIA: 0402; Value: 15.00 Ohm; Tolerance: 1 %; Power: 0.063 W; Technology: SMT
TP300-TP310 = CMP-00224-1: 0.6mm SMT Test Pad; Mounting Technology: SMT
U300 = CMP-00228-1: LC (T-Type) EMI Filter 3rd Order Low Pass 1 Channel C = 47pF 6A 1206 (3216 Metric), 3 PC Pad; Manufacturer: TDK Corporation; Number of Channels: 1; Attenuation Value: -15dB @ 650MHz ~ 2.5GHz; Resistance - Channel (Ohms): 0.002; Values: C = 47pF; ESD Protection: No; Voltage - Rated: 50V; Packaging: Tape & Reel (TR); Part Status: Active; Type: Low Pass; Filter Order: 3rd; Technology: LC (T-Type); Center / Cutoff Frequency: -; Current: 6A; Operating Temperature: -40°C ~ 125°C; Applications: General Purpose; Mounting Type: Surface Mount; Package / Case: 1206 (3216 Metric), 3 PC Pad; Size / Dimension: 0.126" L x 0.063" W (3.20mm x 1.60mm); Height: 0.091" (2.30mm); Manufacturer Part Number: ACH32C-470-T001; Supplier: Digi-Key; Supplier Part Number: 445-2991-2-ND; ComponentLink1Description: 3tf_commercial_power_ach32c_en.pdf; ComponentLink1URL: https://product.tdk.com/info/en/catalog/datasheets/3tf_commercial_power_ach32c_en.pdf
U301 = CMP-00086-1: Instrumentation Amplifier 3nV/Hz Low Power; Manufacturer: Analog Devices Inc.; Brand: Analog Devices; Number of Channels: 1 Channel; CMRR - Common Mode Rejection Ratio: 140 dB; Gain V/V: 1 V/V to 10000 V/V; Ib - Input Bias Current: 6 nA; Maximum Input Resistance: 30 GOhms at +/- 15 V; Operating Supply Current: 2 mA; PSRR - Power Supply Rejection Ratio: 150 dB; SR - Slew Rate: 35 V/us; Supply Voltage - Max: 36 V; Supply Voltage - Min: 5 V; Vcm - Common Mode Voltage: 5 V to 36 V; Voltage Gain dB: 80 dB; Vos - Input Offset Voltage: 25 uV; Amplifier Type: Instrumentation Amplifier; Package / Case: SOIC-8; Packaging: Tube; Product: Operational Amplifiers; Series: AD8421; Mounting Style: SMD/SMT; Maximum Operating Temperature: + 85 C; Minimum Operating Temperature: - 40 C; Standard Pack Qty: 98; RoHS - Mouser: Y; Minimum Order Quantity: 1; Reeling: False; P/N: AD8421BRZ; Supplier: Mouser; Supplier Part Number: 584-AD8421BRZ; ComponentLink1Description: AD8421-249267.pdf; ComponentLink1URL: http://www.mouser.com/ds/2/609/AD8421-249267.pdf
U302#1 U302#2 U303 = CMP-00103-1: SP Amp Zero Drift Amplifier Dual R-R I/O ±27.5V/55V 8-Pin MSOP; Manufacturer: Analog Devices Inc.; Amplifier Type: Zero-Drift; Output Type: Rail-to-Rail; Slew Rate: 1.7 V/µs; Gain Bandwidth Product: 2.7MHz; Current - Input Bias: 50pA; Voltage - Input Offset: 1.5µV; Current - Supply: 830µA; Current - Output / Channel: 32mA; Voltage - Supply, Single/Dual (±): 4.5 V ~ 55 V, ±2.25 V ~ 27.5 V; Packaging: Tube; Number of Circuits: -; -3db Bandwidth: -; Operating Temperature: -40°C ~ 125°C; Mounting Type: Surface Mount; Package / Case: 8-TSSOP, 8-MSOP (0.118", 3.00mm Width); Supplier Device Package: 8-MSOP; Manufacturer Part Number: ADA4522-2ARMZ; Supplier: Digi-Key; Supplier Part Number: ADA4522-2ARMZ-ND; ComponentLink1Description: ADA4522-1_4522-2_4522-4.pdf; ComponentLink1URL: http://www.analog.com/media/en/technical-documentation/data-sheets/ADA4522-1_4522-2_4522-4.pdf
U304 = CMP-00122-1: Instrument Amplifier, 1, 60 V, 35 V/ s, 10 MHz, 5V to 36V, MSOP; Manufacturer: Analog Devices Inc.; Amplifier Type: Instrumentation; Number of Circuits: 1; Slew Rate: 35 V/µs; -3db Bandwidth: 10MHz; Current - Input Bias: 1nA; Voltage - Input Offset: 60µV; Current - Supply: 2mA; Current - Output / Channel: 65mA; Voltage - Supply, Single/Dual (±): 5 V ~ 36 V, ±2.5 V ~ 18 V; Packaging: Tube; Output Type: -; Gain Bandwidth Product: -; Operating Temperature: -40°C ~ 85°C; Mounting Type: Surface Mount; Package / Case: 8-TSSOP, 8-MSOP (0.118", 3.00mm Width); Supplier Device Package: 8-MSOP; P/N: AD8421ARMZ; Supplier: Digi-Key; Supplier Part Number: AD8421ARMZ-ND; ComponentLink1Description: AD8421.pdf; ComponentLink1URL: http://www.analog.com/media/en/technical-documentation/data-sheets/AD8421.pdf
U305 = CMP-00089-1: Analog Comparators Dual 2.2V to 36V microPwr Comparator; Input Type: Rail to Rail; Output Type: Open Collector; Response Time: 780 ns; Brand: Texas Instruments; Comparator Type: General Purpose; Number of Channels: 2 Channel; Ib - Input Bias Current: 15 nA; Operating Supply Current: 75 uA; PSRR - Power Supply Rejection Ratio: 20 uV/V; Vos - Input Offset Voltage: 2.5 mV; Package / Case: VSSOP-8; Packaging: Tube; Product: Analog Comparators; Series: TLV1702; Mounting Style: SMD/SMT; GBP - Gain Bandwidth Product: -; Manufacturer: Texas Instruments; Maximum Operating Temperature: + 125 C; Minimum Operating Temperature: - 40 C; Propagation Delay Time: 780 ns; Standard Pack Qty: 80; Supply Voltage - Max: 36 V; Supply Voltage - Min: 2.2 V; Vcm - Common Mode Voltage: 2.2 V to 36 V; RoHS - Mouser: Y; Minimum Order Quantity: 1; Reeling: False; P/N: TLV1702AIDGK; Supplier: Mouser; Supplier Part Number: 595-TLV1702AIDGK; ComponentLink1Description: tlv1702-556650.pdf; ComponentLink1URL: http://www.mouser.com/ds/2/405/tlv1702-556650.pdf; PartId: 1
U306 = CMP-0859-00454-3: Dual Schmitt-Trigger Inverter, DCK0006A, LARGE T&R; Manufacturer: Texas Instruments; 3-State Output: No; VCC(Min)(V): 1.65; Rating: Catalog; Sub-Family: Inverting Buffer/Driver; Voltage(Nom)(V): 1.8,2.5,3.3,5; Output Drive (IOL/IOH)(Max)(mA): 32/-32; tpd @ Nom Voltage(Max)(ns): 9.5,5.7,5.4,4.3; Schmitt Trigger: Yes; Technology Family: LVC; VCC(Max)(V): 5.5; Logic: Inverting; Output Type: CMOS; Input Type: CMOS/TTL; DatasheetVersion: SCES200M; Generic Part Number: SN74LVC2G14; Operating Temperature Range(C): -40 to 125; PackageReference: DCK0006A; PartId: 1
U307 = CMP-0859-00300-3: Single 2-Input Positive-NAND Gate, DCK0005A, LARGE T&R; Manufacturer: Texas Instruments; Rating: Catalog; Schmitt Trigger: No; Voltage(Nom)(V): 3.3,5; Output Type: CMOS; Logic: True; VCC(Min)(V): 2; tpd @ Nom Voltage(Max)(ns): 11.4,7.5; Technology Family: AHCT; VCC(Max)(V): 5.5; Output Drive (IOL/IOH)(Max)(mA): 50/-50; Gate Type: NAND; F @ Nom Voltage(Max)(Mhz): 75; ICC @ Nom Voltage(Max)(mA): 0.01; Bits(#): 1; Operating Temperature Range(C): -40 to 125; Sub-Family: NAND Gate; ComponentLink2Description: Datasheet; PackageReference: DCK0005A; ComponentLink1Description: Manufacturer URL; ComponentLink1URL: http://www.ti.com/; Part Number: SN74AHCT1G00; 3-State Output: No; DatasheetVersion: SCLS316N; Input Type: CMOS; PartNumber: SN74AHCT1G00DCKR; ComponentLink2URL: http://www.ti.com/lit/ds/symlink/sn74ahct1g00.pdf; PartId: 1; Generic Part Number: SN74AHCT1G00

## Sheet adc.SchDoc: ADC
size A4; DrawnBy: Stefan Lippuner; Organization: TIK; DocumentNumber: 4; Revision: 1; SheetNumber: 4; SheetTotal: 8
Used 2 times, as channels ADC 1, ADC 2. Parts and nets are listed once, with the designators drawn on the sheet.
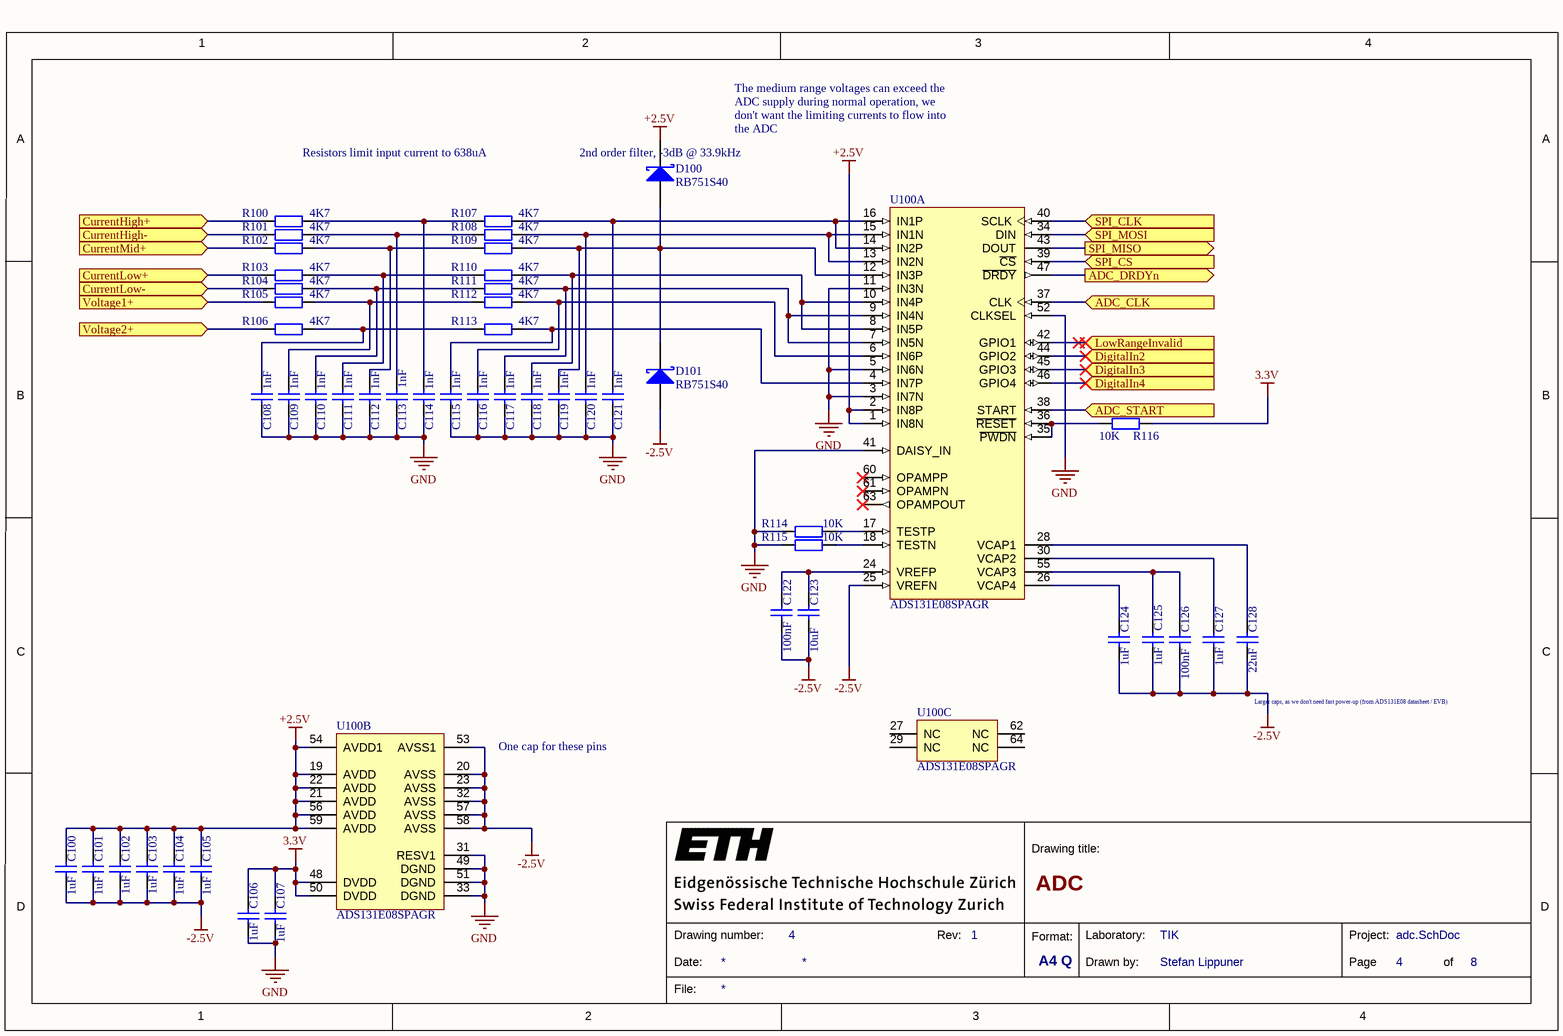
[diagram p2: adc.SchDoc]

### Parts
C100  1uF  [CAPC0402(1005)60_L]
C101  1uF  [CAPC0402(1005)60_L]
C102  1uF  [CAPC0402(1005)60_L]
C103  1uF  [CAPC0402(1005)60_L]
C104  1uF  [CAPC0402(1005)60_L]
C105  1uF  [CAPC0402(1005)60_L]
C106  1uF  [CAPC0402(1005)60_L]
C107  1uF  [CAPC0402(1005)60_L]
C108  1nF  [CAPC0402(1005)60_L]
C109  1nF  [CAPC0402(1005)60_L]
C110  1nF  [CAPC0402(1005)60_L]
C111  1nF  [CAPC0402(1005)60_L]
C112  1nF  [CAPC0402(1005)60_L]
C113  1nF  [CAPC0402(1005)60_L]
C114  1nF  [CAPC0402(1005)60_L]
C115  1nF  [CAPC0402(1005)60_L]
C116  1nF  [CAPC0402(1005)60_L]
C117  1nF  [CAPC0402(1005)60_L]
C118  1nF  [CAPC0402(1005)60_L]
C119  1nF  [CAPC0402(1005)60_L]
C120  1nF  [CAPC0402(1005)60_L]
C121  1nF  [CAPC0402(1005)60_L]
C122  100nF  [CAPC0402(1005)60_L]
C123  10uF  [CAPC0603(1608)100_L]
C124  1uF  [CAPC0402(1005)60_L]
C125  1uF  [CAPC0402(1005)60_L]
C126  100nF  [CAPC0402(1005)60_L]
C127  1uF  [CAPC0402(1005)60_L]
C128  22uF  [CAPC0805(2012)145_L]
D100  RB751S40  [ONSC-SOD-523-2-502-01_V]
D101  RB751S40  [ONSC-SOD-523-2-502-01_V]
R100  4K7  [RESC0402(1005)_L]
R101  4K7  [RESC0402(1005)_L]
R102  4K7  [RESC0402(1005)_L]
R103  4K7  [RESC0402(1005)_L]
R104  4K7  [RESC0402(1005)_L]
R105  4K7  [RESC0402(1005)_L]
R106  4K7  [RESC0402(1005)_L]
R107  4K7  [RESC0402(1005)_L]
R108  4K7  [RESC0402(1005)_L]
R109  4K7  [RESC0402(1005)_L]
R110  4K7  [RESC0402(1005)_L]
R111  4K7  [RESC0402(1005)_L]
R112  4K7  [RESC0402(1005)_L]
R113  4K7  [RESC0402(1005)_L]
R114  10K  [RESC0402(1005)_L]
R115  10K  [RESC0402(1005)_L]
R116  10K  [RESC0402(1005)_L]
U100  ADS131E08SPAGR  [QFP50P1000X1000X120_HS-64L]  (parts A,B,C of 3)

### Ports
ADC_CLK (in), ADC_DRDYn (out), ADC_START (in), CurrentHigh+ (in), CurrentHigh- (in), CurrentLow+ (in), CurrentLow- (in), CurrentMid+ (in), DigitalIn2 (in), DigitalIn3 (in), DigitalIn4 (in), LowRangeInvalid (in), SPI_CLK (in), SPI_CS (in), SPI_MISO (out), SPI_MOSI (in), Voltage1+ (in), Voltage2+ (in)

### Nets
3.3V: C106.2 C107.2 R116.1 U100.48(DVDD) U100.50(DVDD)
+2.5V: C100.2 C101.2 C102.2 C103.2 C104.2 C105.2 D100.1(K) U100.1(IN8N) U100.2(IN8P) U100.19(AVDD) U100.21(AVDD) U100.22(AVDD) U100.54(AVDD1) U100.56(AVDD) U100.59(AVDD)
-2.5V: C100.1 C101.1 C102.1 C103.1 C104.1 C105.1 C122.1 C123.1 C124.1 C125.1 C126.1 C127.1 C128.1 D101.2(A) U100.20(AVSS) U100.23(AVSS) U100.25(VREFN) U100.32(AVSS) U100.53(AVSS1) U100.57(AVSS) U100.58(AVSS)
GND: C106.1 C107.1 C108.1 C109.1 C110.1 C111.1 C112.1 C113.1 C114.1 C115.1 C116.1 C117.1 C118.1 C119.1 C120.1 C121.1 R114.1 R115.1 U100.3(IN7N) U100.5(IN6N) U100.11(IN3N) U100.31(RESV1) U100.33(DGND) U100.41(DAISY_IN) U100.49(DGND) U100.51(DGND) U100.52(CLKSEL)
ADC_CLK: U100.37(CLK) ; port ADC_CLK
ADC_DRDYn: U100.47(~{DRDY}) ; port ADC_DRDYn
ADC_START: U100.38(START) ; port ADC_START
CurrentHigh+: R100.2 ; port CurrentHigh+
CurrentHigh-: R101.2 ; port CurrentHigh-
CurrentLow+: R103.2 ; port CurrentLow+
CurrentLow-: R104.2 ; port CurrentLow-
CurrentMid+: R102.2 ; port CurrentMid+
DigitalIn2: U100.44(GPIO2) ; port DigitalIn2
DigitalIn3: U100.45(GPIO3) ; port DigitalIn3
DigitalIn4: U100.46(GPIO4) ; port DigitalIn4
LowRangeInvalid: U100.42(GPIO1) ; port LowRangeInvalid
SPI_CLK: U100.40(SCLK) ; port SPI_CLK
SPI_CS: U100.39(~{CS}) ; port SPI_CS
SPI_MISO: U100.43(DOUT) ; port SPI_MISO
SPI_MOSI: U100.34(DIN) ; port SPI_MOSI
Voltage1+: R105.2 ; port Voltage1+
Voltage2+: R106.2 ; port Voltage2+
NetC108_2: C108.2 R106.1 R113.2
NetC109_2: C109.2 R105.1 R112.2
NetC110_2: C110.2 R104.1 R111.2
NetC111_2: C111.2 R103.1 R110.2
NetC112_2: C112.2 R102.1 R109.2
NetC113_2: C113.2 R101.1 R108.2
NetC114_2: C114.2 R100.1 R107.2
NetC115_2: C115.2 R113.1 U100.4(IN7P)
NetC116_2: C116.2 R112.1 U100.6(IN6P)
NetC117_2: C117.2 R111.1 U100.7(IN5N) U100.9(IN4N)
NetC118_2: C118.2 R110.1 U100.8(IN5P) U100.10(IN4P)
NetC119_2: C119.2 D100.2(A) D101.1(K) R109.1 U100.12(IN3P)
NetC120_2: C120.2 R108.1 U100.13(IN2N) U100.15(IN1N)
NetC121_2: C121.2 R107.1 U100.14(IN2P) U100.16(IN1P)
NetC122_2: C122.2 C123.2 U100.24(VREFP)
NetC124_2: C124.2 U100.26(VCAP4)
NetC125_2: C125.2 C126.2 U100.55(VCAP3)
NetC127_2: C127.2 U100.30(VCAP2)
NetC128_2: C128.2 U100.28(VCAP1)
NetR114_2: R114.2 U100.17(TESTP)
NetR115_2: R115.2 U100.18(TESTN)
NetR116_2: R116.2 U100.35(~{PWDN}) U100.36(~{RESET})

Not connected (* = marked no-connect by the designer): U100 27(NC) 29(NC) 60(OPAMPP)* 61(OPAMPN)* 62(NC) 63(OPAMPOUT)* 64(NC)

### Channels
ADC 1: designators end in _1; ports ADC_CLK=NetU100_1_37 ADC_DRDYn=NetU100_1_47 ADC_START=NetU100_1_38 CurrentHigh+=NetR100_1_2 CurrentHigh-=NetC311_1_1 CurrentLow+=NetR103_1_2 CurrentLow-=NetC310_1_2 CurrentMid+=OutputMidRange DigitalIn2=DigitalInput1 DigitalIn3=DigitalInput2 DigitalIn4=DigitalInput3 LowRangeInvalid=NetU100_1_42 SPI_CLK=NetU100_1_40 SPI_CS=NetU100_1_39 SPI_MISO=NetU100_1_43 SPI_MOSI=NetU100_1_34 Voltage1+=NetR105_1_2 Voltage2+=NetR106_1_2
ADC 2: designators end in _2; ports ADC_CLK=NetU100_1_37 ADC_DRDYn=NetU100_2_47 ADC_START=NetU100_1_38 CurrentHigh+=NetR100_2_2 CurrentHigh-=NetC311_2_1 CurrentLow+=NetR103_2_2 CurrentLow-=NetC310_2_2 CurrentMid+=OutputMidRange DigitalIn2=DigitalInput4 DigitalIn3=DigitalInput5 DigitalIn4=DigitalInput6 LowRangeInvalid=NetU100_2_42 SPI_CLK=NetU100_1_40 SPI_CS=NetU100_2_39 SPI_MISO=NetU100_2_43 SPI_MOSI=NetU100_1_34 Voltage1+=NetR105_2_2 Voltage2+=NetR106_2_2

### Notes on the sheet
- Resistors limit input current to 638uA
- 2nd order filter, -3dB @ 33.9kHz
- The medium range voltages can exceed the ADC supply during normal operation, we don't want the limiting currents to flow into the ADC
- Larger caps, as we don't need fast power-up (from ADS131E08 datasheet / EVB)
- One cap for these pins
- 1
- 2
- 3
- 4
- A
- B
- C
- Drawing title:
- D
- Date:
- Drawing number:
- Rev:
- Format:
- A4 Q
- Drawn by:
- Laboratory:
- Page
- Project:
- of
- File:

### Library data of the parts
C100-C107 C124 C125 C127 = CMP-1034-02120-1: CAP 1uF 16V ±20% 0402 (1005 Metric) Thickness 0.6mm SMD; Tolerance: Â±20%; Case-EIA: 0402; Case-Metric: 1005; Max Thickness: 0.6 mm; Rated Voltage: 16 V; Value: 1uF; Technology: SMT
C108-C121 = CMP-1034-01626-1: CAP 1nF 50V ±5% 0402 (1005 Metric) Thickness 0.6mm SMD; Case-Metric: 1005; Case-EIA: 0402; Tolerance: Â±5%; Value: 1nF; Rated Voltage: 50 V; Max Thickness: 0.6 mm; Technology: SMT
C122 C126 = CMP-1034-02071-1: as C300 on sheet current_channel; Value: 100nF; Rated Voltage: 16 V; Tolerance: -20% to +80%; Technology: SMT; Max Thickness: 0.6 mm
C123 = CMP-1035-02800-1: as C308 on sheet current_channel; Max Thickness: 1 mm; Rated Voltage: 10 V; Technology: SMT; Value: 10uF
C128 = CMP-1036-04938-1: CAP 22uF 6.3V ±10% 0805 (2012 Metric) Thickness 1.45mm SMD; Tolerance: Â±10%; Case-EIA: 0805; Case-Metric: 2012; Technology: SMT; Rated Voltage: 6.3 V; Max Thickness: 1.45 mm; Value: 22uF
D100 D101 = CMP-00225-2: DIODE SCHOTTKY 40V 30MA SOD523F; Manufacturer: Fairchild Semiconductor; Voltage - Forward (Vf) (Max) @ If: 370mV @ 1mA; Speed: Small Signal =< 200mA (Io), Any Speed; Current - Reverse Leakage @ Vr: 500nA @ 10V; Packaging: Cut Tape (CT); Part Status: Active; Diode Type: Schottky; Voltage - DC Reverse (Vr) (Max): 40V; Current - Average Rectified (Io): 30mA; Reverse Recovery Time (trr): -; Capacitance @ Vr, F: -; Mounting Type: Surface Mount; Package / Case: SC-79, SOD-523F; Supplier Device Package: SOD-523F; Operating Temperature - Junction: -55°C ~ 125°C; Manufacturer Part Number: RB751S40; Supplier: Digi-Key; Supplier Part Number: RB751S40CT-ND; ComponentLink1Description: RB751S40.pdf; ComponentLink1URL: http://www.fairchildsemi.com/datasheets/RB/RB751S40.pdf
R100-R113 = CMP-1011-00586-1: 4K7 0.063W 1% 0402 (1005 Metric)  SMD; Case-Metric: 1005; Value: 4700.00 Ohm; Case-EIA: 0402; Power: 0.063 W; Technology: SMT; Tolerance: 1 %
R114-R116 = CMP-1011-00623-1: as R303 on sheet current_channel; Tolerance: 1 %; Technology: SMT; Power: 0.063 W
U100 = CMP-00105-1: Analog to Digital Converters - ADC 8-Channel, 24-Bit, AFE; Brand: Texas Instruments; Product Status: New Product; Packaging: Reel; Series: ADS131E08S; Manufacturer: Texas Instruments; RoHS - Mouser: Y; Minimum Order Quantity: 1500; Reeling: True; P/N: ADS131E08SPAGR; Supplier: Mouser; Supplier Part Number: 595-ADS131E08SPAGR; ComponentLink1Description: ads131e08s-844698.pdf; ComponentLink1URL: http://www.mouser.com/ds/2/405/ads131e08s-844698.pdf